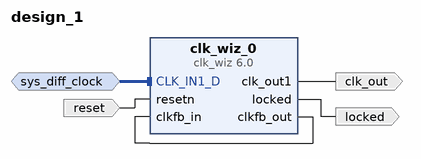
[diagram p0: block diagram of the top level]
# Vivado block design design_1, xc7k325tffg900-2, Vivado 2020.2
create_bd_design design_1

create_bd_intf_port -mode Slave -vlnv xilinx.com:interface:diff_clock_rtl:1.0 sys_diff_clock
set_property -dict {CONFIG.FREQ_HZ 200000000} [get_bd_intf_ports sys_diff_clock]
create_bd_port -dir I -type rst reset
set_property -dict {CONFIG.POLARITY ACTIVE_LOW} [get_bd_ports reset]
create_bd_port -dir O locked
create_bd_port -dir O -type clk clk_out

create_bd_cell -type ip -vlnv xilinx.com:ip:clk_wiz:6.0 clk_wiz_0
set_property -dict [list \
  CONFIG.CLKIN1_JITTER_PS 50.0 \
  CONFIG.CLKIN1_UI_JITTER 0.010 \
  CONFIG.CLKIN2_JITTER_PS 1000000.0 \
  CONFIG.CLKIN2_UI_JITTER 0.010 \
  CONFIG.CLKOUT1_DRIVES No_buffer \
  CONFIG.CLKOUT1_JITTER 83.905 \
  CONFIG.CLKOUT1_PHASE_ERROR 65.553 \
  CONFIG.CLKOUT1_REQUESTED_DUTY_CYCLE 1 \
  CONFIG.CLKOUT1_REQUESTED_OUT_FREQ 100 \
  CONFIG.CLKOUT2_DRIVES BUFG \
  CONFIG.CLKOUT2_JITTER 99.224 \
  CONFIG.CLKOUT2_PHASE_ERROR 76.281 \
  CONFIG.CLKOUT2_REQUESTED_DUTY_CYCLE 50.000 \
  CONFIG.CLKOUT2_USED false \
  CONFIG.CLKOUT3_DRIVES BUFG \
  CONFIG.CLKOUT3_JITTER 99.224 \
  CONFIG.CLKOUT3_PHASE_ERROR 76.281 \
  CONFIG.CLKOUT3_USED false \
  CONFIG.CLKOUT4_DRIVES BUFG \
  CONFIG.CLKOUT4_JITTER 99.224 \
  CONFIG.CLKOUT4_PHASE_ERROR 76.281 \
  CONFIG.CLKOUT4_USED false \
  CONFIG.CLKOUT5_DRIVES BUFG \
  CONFIG.CLKOUT5_JITTER 99.224 \
  CONFIG.CLKOUT5_PHASE_ERROR 76.281 \
  CONFIG.CLKOUT5_USED false \
  CONFIG.CLKOUT6_DRIVES BUFG \
  CONFIG.CLKOUT6_JITTER 99.224 \
  CONFIG.CLKOUT6_PHASE_ERROR 76.281 \
  CONFIG.CLKOUT6_USED false \
  CONFIG.CLKOUT7_DRIVES BUFG \
  CONFIG.CLKOUT7_JITTER 99.224 \
  CONFIG.CLKOUT7_PHASE_ERROR 76.281 \
  CONFIG.CLKOUT7_USED false \
  CONFIG.CLK_IN1_BOARD_INTERFACE sys_diff_clock \
  CONFIG.FEEDBACK_SOURCE FDBK_ONCHIP \
  CONFIG.JITTER_OPTIONS UI \
  CONFIG.MMCM_BANDWIDTH OPTIMIZED \
  CONFIG.MMCM_CLKFBOUT_MULT_F 9 \
  CONFIG.MMCM_CLKIN1_PERIOD 5.000 \
  CONFIG.MMCM_CLKIN2_PERIOD 10.000 \
  CONFIG.MMCM_CLKOUT0_DIVIDE_F 18 \
  CONFIG.MMCM_CLKOUT0_DUTY_CYCLE 0.056 \
  CONFIG.MMCM_CLKOUT1_DIVIDE 1 \
  CONFIG.MMCM_CLKOUT2_DIVIDE 1 \
  CONFIG.MMCM_CLKOUT3_DIVIDE 1 \
  CONFIG.MMCM_CLKOUT4_DIVIDE 1 \
  CONFIG.MMCM_CLKOUT5_DIVIDE 1 \
  CONFIG.MMCM_CLKOUT6_DIVIDE 1 \
  CONFIG.MMCM_COMPENSATION ZHOLD \
  CONFIG.MMCM_DIVCLK_DIVIDE 1 \
  CONFIG.MMCM_REF_JITTER2 0.010 \
  CONFIG.NUM_OUT_CLKS 1 \
  CONFIG.PRIMITIVE PLL \
  CONFIG.PRIM_SOURCE Differential_clock_capable_pin \
  CONFIG.RESET_BOARD_INTERFACE reset \
  CONFIG.RESET_PORT resetn \
  CONFIG.RESET_TYPE ACTIVE_LOW \
  CONFIG.USE_BOARD_FLOW true \
  CONFIG.USE_LOCKED true \
] [get_bd_cells clk_wiz_0]

# ---- connections ----

connect_bd_intf_net [get_bd_intf_ports sys_diff_clock] [get_bd_intf_pins clk_wiz_0/CLK_IN1_D]
connect_bd_net [get_bd_ports reset] [get_bd_pins clk_wiz_0/resetn]
connect_bd_net [get_bd_pins clk_wiz_0/clkfb_out] [get_bd_pins clk_wiz_0/clkfb_in]
connect_bd_net [get_bd_pins clk_wiz_0/locked] [get_bd_ports locked]
connect_bd_net [get_bd_pins clk_wiz_0/clk_out1] [get_bd_ports clk_out]

validate_bd_design
save_bd_design
